# EAGLE design PGTN_daisy3_exp_32io (EAGLE 9.6.0)
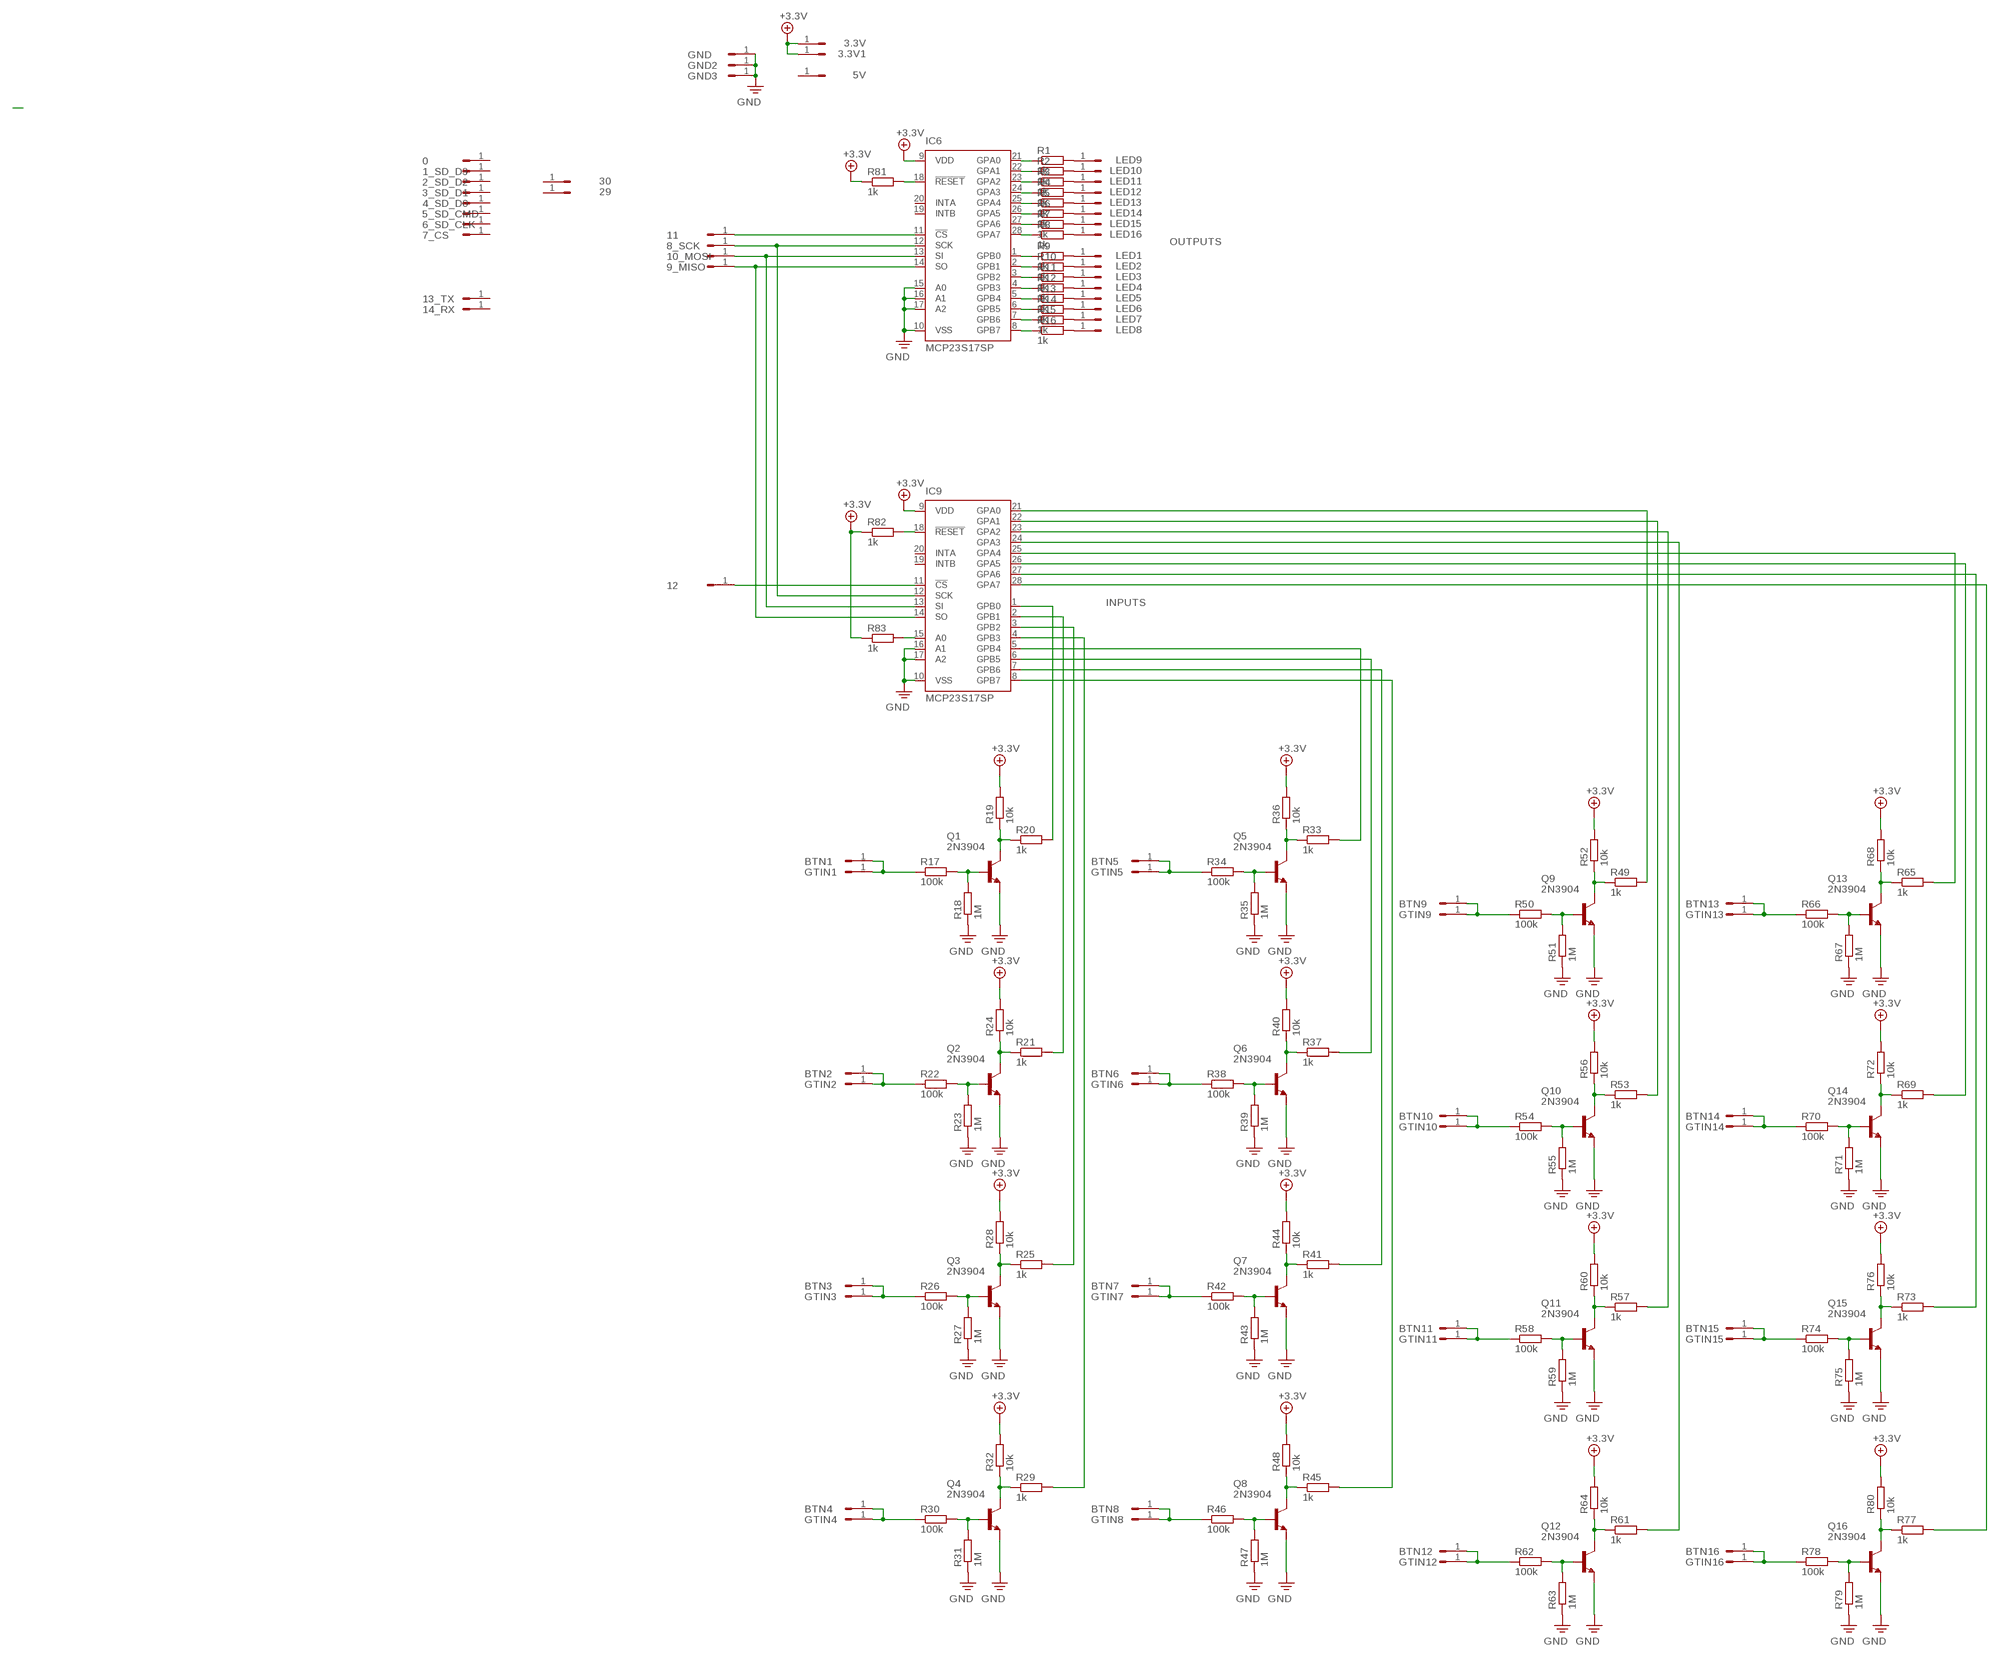
[diagram p0: schematic, sheet 1]

## Parts
0  HEADER/MALE/01  [HEADER/MALE/01]
1_SD_D3  HEADER/MALE/01  [HEADER/MALE/01]
2_SD_D2  HEADER/MALE/01  [HEADER/MALE/01]
3.3V  HEADER/MALE/01  [HEADER/MALE/01]
3.3V1  HEADER/MALE/01  [HEADER/MALE/01]
3_SD_D1  HEADER/MALE/01  [HEADER/MALE/01]
4_SD_D0  HEADER/MALE/01  [HEADER/MALE/01]
5_SD_CMD  HEADER/MALE/01  [HEADER/MALE/01]
5V  HEADER/MALE/01  [HEADER/MALE/01]
6_SD_CLK  HEADER/MALE/01  [HEADER/MALE/01]
7_CS  HEADER/MALE/01  [HEADER/MALE/01]
8_SCK  HEADER/MALE/01  [HEADER/MALE/01]
9_MISO  HEADER/MALE/01  [HEADER/MALE/01]
10_MOSI  HEADER/MALE/01  [HEADER/MALE/01]
11  HEADER/MALE/01  [HEADER/MALE/01]
12  HEADER/MALE/01  [HEADER/MALE/01]
13_TX  HEADER/MALE/01  [HEADER/MALE/01]
14_RX  HEADER/MALE/01  [HEADER/MALE/01]
29  HEADER/MALE/01  [HEADER/MALE/01]
30  HEADER/MALE/01  [HEADER/MALE/01]
BTN1  HEADER/MALE/01  [HEADER/MALE/01]
BTN2  HEADER/MALE/01  [HEADER/MALE/01]
BTN3  HEADER/MALE/01  [HEADER/MALE/01]
BTN4  HEADER/MALE/01  [HEADER/MALE/01]
BTN5  HEADER/MALE/01  [HEADER/MALE/01]
BTN6  HEADER/MALE/01  [HEADER/MALE/01]
BTN7  HEADER/MALE/01  [HEADER/MALE/01]
BTN8  HEADER/MALE/01  [HEADER/MALE/01]
BTN9  HEADER/MALE/01  [HEADER/MALE/01]
BTN10  HEADER/MALE/01  [HEADER/MALE/01]
BTN11  HEADER/MALE/01  [HEADER/MALE/01]
BTN12  HEADER/MALE/01  [HEADER/MALE/01]
BTN13  HEADER/MALE/01  [HEADER/MALE/01]
BTN14  HEADER/MALE/01  [HEADER/MALE/01]
BTN15  HEADER/MALE/01  [HEADER/MALE/01]
BTN16  HEADER/MALE/01  [HEADER/MALE/01]
GND  HEADER/MALE/01  [HEADER/MALE/01]
GND2  HEADER/MALE/01  [HEADER/MALE/01]
GND3  HEADER/MALE/01  [HEADER/MALE/01]
GTIN1  HEADER/MALE/01  [HEADER/MALE/01]
GTIN2  HEADER/MALE/01  [HEADER/MALE/01]
GTIN3  HEADER/MALE/01  [HEADER/MALE/01]
GTIN4  HEADER/MALE/01  [HEADER/MALE/01]
GTIN5  HEADER/MALE/01  [HEADER/MALE/01]
GTIN6  HEADER/MALE/01  [HEADER/MALE/01]
GTIN7  HEADER/MALE/01  [HEADER/MALE/01]
GTIN8  HEADER/MALE/01  [HEADER/MALE/01]
GTIN9  HEADER/MALE/01  [HEADER/MALE/01]
GTIN10  HEADER/MALE/01  [HEADER/MALE/01]
GTIN11  HEADER/MALE/01  [HEADER/MALE/01]
GTIN12  HEADER/MALE/01  [HEADER/MALE/01]
GTIN13  HEADER/MALE/01  [HEADER/MALE/01]
GTIN14  HEADER/MALE/01  [HEADER/MALE/01]
GTIN15  HEADER/MALE/01  [HEADER/MALE/01]
GTIN16  HEADER/MALE/01  [HEADER/MALE/01]
IC6  MCP23S17SP  [DIL28-3]
IC9  MCP23S17SP  [DIL28-3]
LED1  HEADER/MALE/01  [HEADER/MALE/01]
LED2  HEADER/MALE/01  [HEADER/MALE/01]
LED3  HEADER/MALE/01  [HEADER/MALE/01]
LED4  HEADER/MALE/01  [HEADER/MALE/01]
LED5  HEADER/MALE/01  [HEADER/MALE/01]
LED6  HEADER/MALE/01  [HEADER/MALE/01]
LED7  HEADER/MALE/01  [HEADER/MALE/01]
LED8  HEADER/MALE/01  [HEADER/MALE/01]
LED9  HEADER/MALE/01  [HEADER/MALE/01]
LED10  HEADER/MALE/01  [HEADER/MALE/01]
LED11  HEADER/MALE/01  [HEADER/MALE/01]
LED12  HEADER/MALE/01  [HEADER/MALE/01]
LED13  HEADER/MALE/01  [HEADER/MALE/01]
LED14  HEADER/MALE/01  [HEADER/MALE/01]
LED15  HEADER/MALE/01  [HEADER/MALE/01]
LED16  HEADER/MALE/01  [HEADER/MALE/01]
Q1  2N3904  [TO92]
Q2  2N3904  [TO92]
Q3  2N3904  [TO92]
Q4  2N3904  [TO92]
Q5  2N3904  [TO92]
Q6  2N3904  [TO92]
Q7  2N3904  [TO92]
Q8  2N3904  [TO92]
Q9  2N3904  [TO92]
Q10  2N3904  [TO92]
Q11  2N3904  [TO92]
Q12  2N3904  [TO92]
Q13  2N3904  [TO92]
Q14  2N3904  [TO92]
Q15  2N3904  [TO92]
Q16  2N3904  [TO92]
R1  1k  RESISTORRESISTOR/UPRIGHT/7.5  [RESISTOR/7.5]
R2  1k  RESISTORRESISTOR/UPRIGHT/7.5  [RESISTOR/7.5]
R3  1k  RESISTORRESISTOR/UPRIGHT/7.5  [RESISTOR/7.5]
R4  1k  RESISTORRESISTOR/UPRIGHT/7.5  [RESISTOR/7.5]
R5  1k  RESISTORRESISTOR/UPRIGHT/7.5  [RESISTOR/7.5]
R6  1k  RESISTORRESISTOR/UPRIGHT/7.5  [RESISTOR/7.5]
R7  1k  RESISTORRESISTOR/UPRIGHT/7.5  [RESISTOR/7.5]
R8  1k  RESISTORRESISTOR/UPRIGHT/7.5  [RESISTOR/7.5]
R9  1k  RESISTORRESISTOR/UPRIGHT/7.5  [RESISTOR/7.5]
R10  1k  RESISTORRESISTOR/UPRIGHT/7.5  [RESISTOR/7.5]
R11  1k  RESISTORRESISTOR/UPRIGHT/7.5  [RESISTOR/7.5]
R12  1k  RESISTORRESISTOR/UPRIGHT/7.5  [RESISTOR/7.5]
R13  1k  RESISTORRESISTOR/UPRIGHT/7.5  [RESISTOR/7.5]
R14  1k  RESISTORRESISTOR/UPRIGHT/7.5  [RESISTOR/7.5]
R15  1k  RESISTORRESISTOR/UPRIGHT/7.5  [RESISTOR/7.5]
R16  1k  RESISTORRESISTOR/UPRIGHT/7.5  [RESISTOR/7.5]
R17  100k  RESISTORRESISTOR/UPRIGHT/7.5  [RESISTOR/7.5]
R18  1M  RESISTORRESISTOR/UPRIGHT/7.5  [RESISTOR/7.5]
R19  10k  RESISTORRESISTOR/UPRIGHT/7.5  [RESISTOR/7.5]
R20  1k  RESISTORRESISTOR/UPRIGHT/7.5  [RESISTOR/7.5]
R21  1k  RESISTORRESISTOR/UPRIGHT/7.5  [RESISTOR/7.5]
R22  100k  RESISTORRESISTOR/UPRIGHT/7.5  [RESISTOR/7.5]
R23  1M  RESISTORRESISTOR/UPRIGHT/7.5  [RESISTOR/7.5]
R24  10k  RESISTORRESISTOR/UPRIGHT/7.5  [RESISTOR/7.5]
R25  1k  RESISTORRESISTOR/UPRIGHT/7.5  [RESISTOR/7.5]
R26  100k  RESISTORRESISTOR/UPRIGHT/7.5  [RESISTOR/7.5]
R27  1M  RESISTORRESISTOR/UPRIGHT/7.5  [RESISTOR/7.5]
R28  10k  RESISTORRESISTOR/UPRIGHT/7.5  [RESISTOR/7.5]
R29  1k  RESISTORRESISTOR/UPRIGHT/7.5  [RESISTOR/7.5]
R30  100k  RESISTORRESISTOR/UPRIGHT/7.5  [RESISTOR/7.5]
R31  1M  RESISTORRESISTOR/UPRIGHT/7.5  [RESISTOR/7.5]
R32  10k  RESISTORRESISTOR/UPRIGHT/7.5  [RESISTOR/7.5]
R33  1k  RESISTORRESISTOR/UPRIGHT/7.5  [RESISTOR/7.5]
R34  100k  RESISTORRESISTOR/UPRIGHT/7.5  [RESISTOR/7.5]
R35  1M  RESISTORRESISTOR/UPRIGHT/7.5  [RESISTOR/7.5]
R36  10k  RESISTORRESISTOR/UPRIGHT/7.5  [RESISTOR/7.5]
R37  1k  RESISTORRESISTOR/UPRIGHT/7.5  [RESISTOR/7.5]
R38  100k  RESISTORRESISTOR/UPRIGHT/7.5  [RESISTOR/7.5]
R39  1M  RESISTORRESISTOR/UPRIGHT/7.5  [RESISTOR/7.5]
R40  10k  RESISTORRESISTOR/UPRIGHT/7.5  [RESISTOR/7.5]
R41  1k  RESISTORRESISTOR/UPRIGHT/7.5  [RESISTOR/7.5]
R42  100k  RESISTORRESISTOR/UPRIGHT/7.5  [RESISTOR/7.5]
R43  1M  RESISTORRESISTOR/UPRIGHT/7.5  [RESISTOR/7.5]
R44  10k  RESISTORRESISTOR/UPRIGHT/7.5  [RESISTOR/7.5]
R45  1k  RESISTORRESISTOR/UPRIGHT/7.5  [RESISTOR/7.5]
R46  100k  RESISTORRESISTOR/UPRIGHT/7.5  [RESISTOR/7.5]
R47  1M  RESISTORRESISTOR/UPRIGHT/7.5  [RESISTOR/7.5]
R48  10k  RESISTORRESISTOR/UPRIGHT/7.5  [RESISTOR/7.5]
R49  1k  RESISTORRESISTOR/UPRIGHT/7.5  [RESISTOR/7.5]
R50  100k  RESISTORRESISTOR/UPRIGHT/7.5  [RESISTOR/7.5]
R51  1M  RESISTORRESISTOR/UPRIGHT/7.5  [RESISTOR/7.5]
R52  10k  RESISTORRESISTOR/UPRIGHT/7.5  [RESISTOR/7.5]
R53  1k  RESISTORRESISTOR/UPRIGHT/7.5  [RESISTOR/7.5]
R54  100k  RESISTORRESISTOR/UPRIGHT/7.5  [RESISTOR/7.5]
R55  1M  RESISTORRESISTOR/UPRIGHT/7.5  [RESISTOR/7.5]
R56  10k  RESISTORRESISTOR/UPRIGHT/7.5  [RESISTOR/7.5]
R57  1k  RESISTORRESISTOR/UPRIGHT/7.5  [RESISTOR/7.5]
R58  100k  RESISTORRESISTOR/UPRIGHT/7.5  [RESISTOR/7.5]
R59  1M  RESISTORRESISTOR/UPRIGHT/7.5  [RESISTOR/7.5]
R60  10k  RESISTORRESISTOR/UPRIGHT/7.5  [RESISTOR/7.5]
R61  1k  RESISTORRESISTOR/UPRIGHT/7.5  [RESISTOR/7.5]
R62  100k  RESISTORRESISTOR/UPRIGHT/7.5  [RESISTOR/7.5]
R63  1M  RESISTORRESISTOR/UPRIGHT/7.5  [RESISTOR/7.5]
R64  10k  RESISTORRESISTOR/UPRIGHT/7.5  [RESISTOR/7.5]
R65  1k  RESISTORRESISTOR/UPRIGHT/7.5  [RESISTOR/7.5]
R66  100k  RESISTORRESISTOR/UPRIGHT/7.5  [RESISTOR/7.5]
R67  1M  RESISTORRESISTOR/UPRIGHT/7.5  [RESISTOR/7.5]
R68  10k  RESISTORRESISTOR/UPRIGHT/7.5  [RESISTOR/7.5]
R69  1k  RESISTORRESISTOR/UPRIGHT/7.5  [RESISTOR/7.5]
R70  100k  RESISTORRESISTOR/UPRIGHT/7.5  [RESISTOR/7.5]
R71  1M  RESISTORRESISTOR/UPRIGHT/7.5  [RESISTOR/7.5]
R72  10k  RESISTORRESISTOR/UPRIGHT/7.5  [RESISTOR/7.5]
R73  1k  RESISTORRESISTOR/UPRIGHT/7.5  [RESISTOR/7.5]
R74  100k  RESISTORRESISTOR/UPRIGHT/7.5  [RESISTOR/7.5]
R75  1M  RESISTORRESISTOR/UPRIGHT/7.5  [RESISTOR/7.5]
R76  10k  RESISTORRESISTOR/UPRIGHT/7.5  [RESISTOR/7.5]
R77  1k  RESISTORRESISTOR/UPRIGHT/7.5  [RESISTOR/7.5]
R78  100k  RESISTORRESISTOR/UPRIGHT/7.5  [RESISTOR/7.5]
R79  1M  RESISTORRESISTOR/UPRIGHT/7.5  [RESISTOR/7.5]
R80  10k  RESISTORRESISTOR/UPRIGHT/7.5  [RESISTOR/7.5]
R81  1k  RESISTORRESISTOR/UPRIGHT/7.5  [RESISTOR/7.5]
R82  1k  RESISTORRESISTOR/UPRIGHT/7.5  [RESISTOR/7.5]
R83  1k  RESISTORRESISTOR/UPRIGHT/7.5  [RESISTOR/7.5]

## Nets
25_GTIN1: IC9.23(GPA2) R57.2
25_GTIN2: IC9.24(GPA3) R61.2
25_GTIN3: IC9.3(GPB2) R25.2
25_GTIN4: IC9.4(GPB3) R29.2
25_GTIN5: IC9.5(GPB4) R33.2
25_GTIN6: IC9.6(GPB5) R37.2
25_GTIN7: IC9.7(GPB6) R41.2
25_GTIN8: IC9.8(GPB7) R45.2
25_GTIN9: IC9.25(GPA4) R65.2
25_GTIN10: IC9.26(GPA5) R69.2
25_GTIN11: IC9.27(GPA6) R73.2
25_GTIN12: IC9.28(GPA7) R77.2
+5V: 3.3V1.1 3.3V.1 IC6.9(VDD) IC9.9(VDD) R19.2 R24.2 R28.2 R32.2 R36.2 R40.2 R44.2 R48.2 R52.2 R56.2 R60.2 R64.2 R68.2 R72.2 R76.2 R80.2 R81.1 R82.1 R83.1 ; supply symbol labelled +3.3V
N$1: BTN2.1 GTIN2.1 R22.1
N$2: Q2.2(B) R22.2 R23.2
N$3: Q2.1(C) R21.1 R24.1
N$4: BTN3.1 GTIN3.1 R26.1
N$5: Q3.2(B) R26.2 R27.2
N$6: Q3.1(C) R25.1 R28.1
N$7: BTN4.1 GTIN4.1 R30.1
N$8: IC6.21(GPA0) R1.1
N$9: Q4.2(B) R30.2 R31.2
N$10: Q4.1(C) R29.1 R32.1
N$11: BTN5.1 GTIN5.1 R34.1
N$12: Q5.2(B) R34.2 R35.2
N$13: IC6.22(GPA1) R2.1
N$14: IC6.23(GPA2) R3.1
N$15: Q5.1(C) R33.1 R36.1
N$16: IC6.24(GPA3) R4.1
N$17: BTN6.1 GTIN6.1 R38.1
N$18: IC6.25(GPA4) R5.1
N$19: IC6.26(GPA5) R6.1
N$20: Q6.2(B) R38.2 R39.2
N$21: Q6.1(C) R37.1 R40.1
N$22: BTN7.1 GTIN7.1 R42.1
N$24: Q7.2(B) R42.2 R43.2
N$25: IC6.27(GPA6) R7.1
N$26: Q7.1(C) R41.1 R44.1
N$27: BTN8.1 GTIN8.1 R46.1
N$29: Q8.2(B) R46.2 R47.2
N$30: Q8.1(C) R45.1 R48.1
N$31: IC9.1(GPB0) R20.2
N$32: IC9.2(GPB1) R21.2
N$33: 9_MISO.1 IC6.14(SO) IC9.14(SO)
N$34: 8_SCK.1 IC6.12(SCK) IC9.12(SCK)
N$35: 10_MOSI.1 IC6.13(SI) IC9.13(SI)
N$36: 11.1 IC6.11(!CS)
N$37: 12.1 IC9.11(!CS)
N$38: BTN9.1 GTIN9.1 R50.1
N$39: Q9.2(B) R50.2 R51.2
N$40: Q9.1(C) R49.1 R52.1
N$41: BTN10.1 GTIN10.1 R54.1
N$43: Q10.2(B) R54.2 R55.2
N$44: Q10.1(C) R53.1 R56.1
N$45: BTN11.1 GTIN11.1 R58.1
N$46: Q11.2(B) R58.2 R59.2
N$48: Q11.1(C) R57.1 R60.1
N$49: BTN12.1 GTIN12.1 R62.1
N$50: Q12.2(B) R62.2 R63.2
N$51: Q12.1(C) R61.1 R64.1
N$52: BTN13.1 GTIN13.1 R66.1
N$54: IC6.28(GPA7) R8.1
N$55: IC6.1(GPB0) R9.1
N$56: IC6.2(GPB1) R10.1
N$57: IC6.3(GPB2) R11.1
N$58: IC6.4(GPB3) R12.1
N$59: IC6.5(GPB4) R13.1
N$60: IC6.6(GPB5) R14.1
N$66: Q13.2(B) R66.2 R67.2
N$67: Q13.1(C) R65.1 R68.1
N$68: IC6.7(GPB6) R15.1
N$69: IC6.8(GPB7) R16.1
N$70: BTN1.1 GTIN1.1 R17.1
N$71: Q1.2(B) R17.2 R18.2
N$72: Q1.1(C) R19.1 R20.1
N$74: BTN14.1 GTIN14.1 R70.1
N$75: Q14.2(B) R70.2 R71.2
N$76: Q14.1(C) R69.1 R72.1
N$77: BTN15.1 GTIN15.1 R74.1
N$78: Q15.2(B) R74.2 R75.2
N$79: Q15.1(C) R73.1 R76.1
N$80: BTN16.1 GTIN16.1 R78.1
N$81: Q16.2(B) R78.2 R79.2
N$82: Q16.1(C) R77.1 R80.1
N$83: IC9.21(GPA0) R49.2
N$84: IC9.22(GPA1) R53.2
N$85: LED1.1 R9.2
N$86: LED2.1 R10.2
N$87: LED3.1 R11.2
N$88: LED4.1 R12.2
N$89: LED5.1 R13.2
N$90: LED6.1 R14.2
N$91: LED7.1 R15.2
N$92: LED8.1 R16.2
N$93: LED9.1 R1.2
N$94: LED10.1 R2.2
N$95: LED11.1 R3.2
N$96: LED12.1 R4.2
N$97: LED13.1 R5.2
N$98: LED14.1 R6.2
N$99: LED15.1 R7.2
N$100: LED16.1 R8.2
N$101: IC6.18(!RESET) R81.2
N$102: IC9.18(!RESET) R82.2
N$108: IC9.15(A0) R83.2
PE: GND2.1 GND3.1 GND.1 IC6.10(VSS) IC6.15(A0) IC6.16(A1) IC6.17(A2) IC9.10(VSS) IC9.16(A1) IC9.17(A2) Q1.3(E) Q2.3(E) Q3.3(E) Q4.3(E) Q5.3(E) Q6.3(E) Q7.3(E) Q8.3(E) Q9.3(E) Q10.3(E) Q11.3(E) Q12.3(E) Q13.3(E) Q14.3(E) Q15.3(E) Q16.3(E) R18.1 R23.1 R27.1 R31.1 R35.1 R39.1 R43.1 R47.1 R51.1 R55.1 R59.1 R63.1 R67.1 R71.1 R75.1 R79.1 ; supply symbol labelled GND
Unconnected: 0.1 1_SD_D3.1 2_SD_D2.1 3_SD_D1.1 4_SD_D0.1 5_SD_CMD.1 5V.1 6_SD_CLK.1 7_CS.1 13_TX.1 14_RX.1 29.1 30.1 IC6.19(INTB) IC6.20(INTA) IC9.19(INTB) IC9.20(INTA)

## Notes on the sheet
- OUTPUTS
- INPUTS

## Library data of the parts
0 1_SD_D3 2_SD_D2 3.3V 3.3V1 3_SD_D1 4_SD_D0 5_SD_CMD 5V 6_SD_CLK 7_CS 8_SCK 9_MISO 10_MOSI 11 12 13_TX 14_RX 29 30 BTN1-BTN16 GND GND2 GND3 GTIN1-GTIN16 LED1-LED16 = connectors:HEADER/MALE/01; SPICEPREFIX: X
IC6 IC9 = ic_digital:MCP23S17: http://ww1.microchip.com/downloads/en/DeviceDoc/21952a.pdf Source: http://ww1.microchip.com/downloads/en/DeviceDoc/21952a.pdf; MF: MICROCHIP; MPN: MCP23S17-E/SP; OC_FARNELL: 1292238; OC_NEWARK: 31K2951
Q1-Q16 = transistors:2N3904: NPN Transistor
R1-R83 = resistors:RESISTOR: RESISTOR, European symbol

## Board
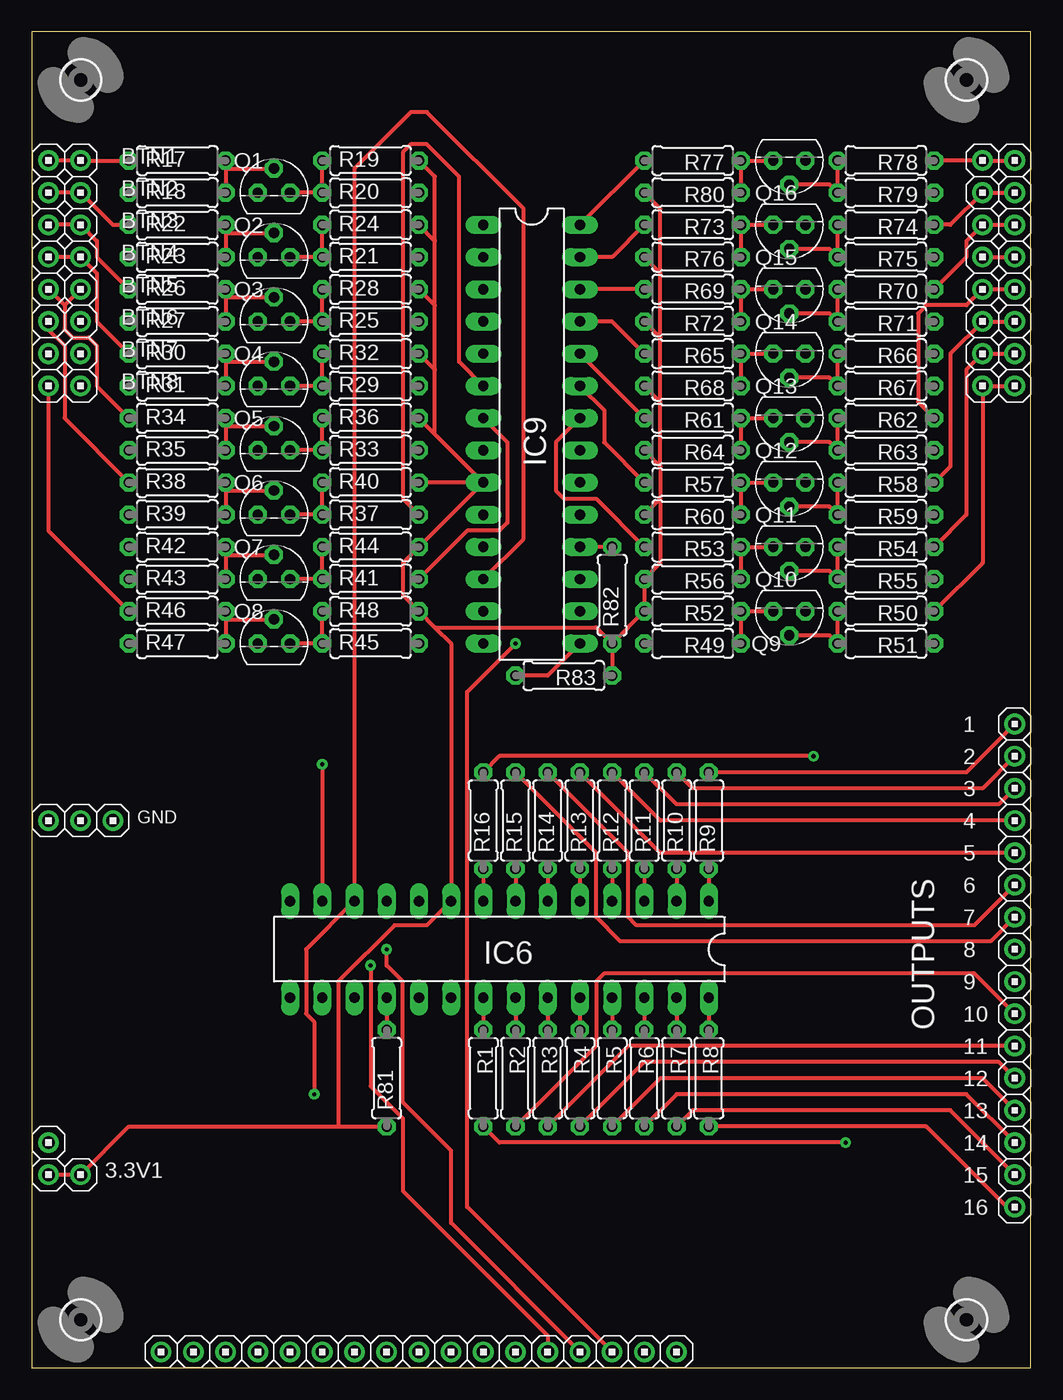
[diagram p1: board, top side]
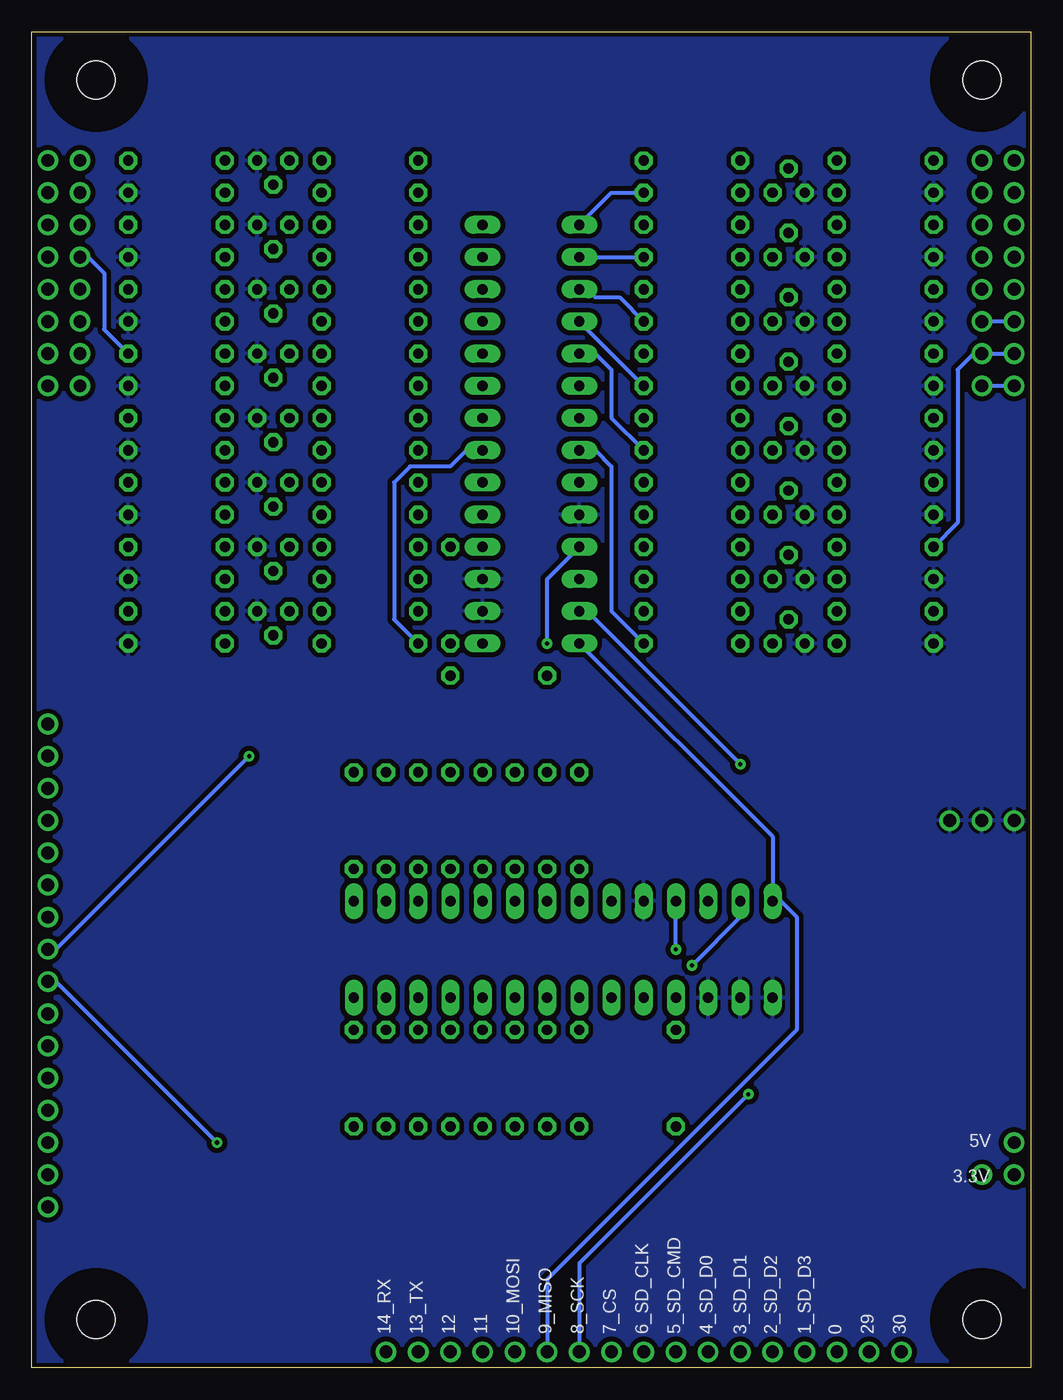
[diagram p2: board, bottom side, seen from below]

Size 78.79 x 105.4 mm. Coordinates in mm from the lower left corner, seen from the top.
Outline: 78.79,105.4 0,105.4 0,0 78.79,0 78.79,105.4
Copper layers (1*16): Top 0.0356mm / dielectric 1.5011mm / Bottom 0.0356mm
Design rules "pigatron": minimum track width 12mil, minimum drill 13mil, track to track 15mil, track to pad 10mil, pad to pad 10mil, via to via 10mil, smd to smd 6mil, copper to edge 15mil, drill to drill 10mil, minimum pad ring 12mil, minimum via ring 10mil, stop-mask expansion 4mil, vias tented up to drill 0mil, thermal gap 10mil

### Footprints (pad centres in the part's own frame; a part is rotated, then mirrored left to right if it is on the bottom)
HEADER/MALE/01 = drill 1.016: 1 0,0
DIL28-3 = drill 0.813 long: 1 -16.51,-3.81; 2 -13.97,-3.81; 3 -11.43,-3.81; 4 -8.89,-3.81; 5 -6.35,-3.81; 6 -3.81,-3.81; 7 -1.27,-3.81; 8 1.27,-3.81; 9 3.81,-3.81; 10 6.35,-3.81; 11 8.89,-3.81; 12 11.43,-3.81; 13 13.97,-3.81; 14 16.51,-3.81; 15 16.51,3.81; 16 13.97,3.81; 17 11.43,3.81; 18 8.89,3.81; 19 6.35,3.81; 20 3.81,3.81; 21 1.27,3.81; 22 -1.27,3.81; 23 -3.81,3.81; 24 -6.35,3.81; 25 -8.89,3.81; 26 -11.43,3.81; 27 -13.97,3.81; 28 -16.51,3.81
TO92 = drill 0.813 octagon: 1 1.27,0; 2 0,1.905; 3 -1.27,0
RESISTOR/7.5 = drill 0.813 octagon: 1 -3.81,0; 2 3.81,0
STANDOFF/3.0 = hole 3: 0,0

### Placement (x,y rotation side)
0  15.29,1.26 90 top
1_SD_D3  17.83,1.26 90 top
2_SD_D2  20.37,1.26 90 top
3.3V  1.32,15.23 270 top
3.3V1  3.86,15.23 0 top
3_SD_D1  22.91,1.26 90 top
4_SD_D0  25.45,1.26 90 top
5_SD_CMD  27.99,1.26 90 top
5V  1.32,17.77 180 top
6_SD_CLK  30.53,1.26 90 top
7_CS  33.07,1.26 90 top
8_SCK  35.61,1.26 90 top
9_MISO  38.15,1.26 90 top
10_MOSI  40.69,1.26 90 top
11  43.23,1.26 90 top
12  45.77,1.26 90 top
13_TX  48.31,1.26 90 top
14_RX  50.85,1.26 90 top
29  12.75,1.26 90 top
30  10.21,1.26 90 top
BTN1  3.86,95.24 0 top
BTN2  3.86,92.7 0 top
BTN3  3.86,90.16 0 top
BTN4  3.86,87.62 0 top
BTN5  3.86,85.08 0 top
BTN6  3.86,82.54 0 top
BTN7  3.86,80 0 top
BTN8  3.86,77.46 0 top
BTN9  74.98,77.46 0 top
BTN10  74.98,80 0 top
BTN11  74.98,82.54 0 top
BTN12  74.98,85.08 0 top
BTN13  74.98,87.62 0 top
BTN14  74.98,90.16 0 top
BTN15  74.98,92.7 0 top
BTN16  74.98,95.24 0 top
GND  6.4,43.17 0 top
GND2  1.32,43.17 180 top
GND3  3.86,43.17 180 top
GTIN1  1.32,95.24 0 top
GTIN2  1.32,92.7 0 top
GTIN3  1.32,90.16 0 top
GTIN4  1.32,87.62 0 top
GTIN5  1.32,85.08 0 top
GTIN6  1.32,82.54 0 top
GTIN7  1.32,80 0 top
GTIN8  1.32,77.46 0 top
GTIN9  77.52,77.46 0 top
GTIN10  77.52,80 0 top
GTIN11  77.52,82.54 0 top
GTIN12  77.52,85.08 0 top
GTIN13  77.52,87.62 0 top
GTIN14  77.52,90.16 0 top
GTIN15  77.52,92.7 0 top
GTIN16  77.52,95.24 0 top
IC6  36.88,33.01 180 top
IC9  39.42,73.65 270 top
LED1  77.52,50.79 180 top
LED2  77.52,48.25 180 top
LED3  77.52,45.71 0 top
LED4  77.52,43.17 0 top
LED5  77.52,40.63 0 top
LED6  77.52,38.09 0 top
LED7  77.52,35.55 0 top
LED8  77.52,33.01 0 top
LED9  77.52,30.47 0 top
LED10  77.52,27.93 0 top
LED11  77.52,25.39 0 top
LED12  77.52,22.85 0 top
LED13  77.52,20.31 0 top
LED14  77.52,17.77 0 top
LED15  77.52,15.23 0 top
LED16  77.52,12.69 0 top
Q1  19.1,92.7 0 top
Q2  19.1,87.62 0 top
Q3  19.1,82.54 0 top
Q4  19.1,77.46 0 top
Q5  19.1,72.38 0 top
Q6  19.1,67.3 0 top
Q7  19.1,62.22 0 top
Q8  19.1,57.14 0 top
Q9  59.74,59.68 180 top
Q10  59.74,64.76 180 top
Q11  59.74,69.84 180 top
Q12  59.74,74.92 180 top
Q13  59.74,80 180 top
Q14  59.74,85.08 180 top
Q15  59.74,90.16 180 top
Q16  59.74,95.24 180 top
R1  35.61,22.85 270 top
R2  38.15,22.85 270 top
R3  40.69,22.85 270 top
R4  43.23,22.85 270 top
R5  45.77,22.85 270 top
R6  48.31,22.85 270 top
R7  50.85,22.85 270 top
R8  53.39,22.85 270 top
R9  53.39,43.17 90 top
R10  50.85,43.17 90 top
R11  48.31,43.17 90 top
R12  45.77,43.17 90 top
R13  43.23,43.17 90 top
R14  40.69,43.17 90 top
R15  38.15,43.17 90 top
R16  35.61,43.17 90 top
R17  11.48,95.24 0 top
R18  11.48,92.7 0 top
R19  26.72,95.24 0 top
R20  26.72,92.7 0 top
R21  26.72,87.62 0 top
R22  11.48,90.16 0 top
R23  11.48,87.62 0 top
R24  26.72,90.16 0 top
R25  26.72,82.54 0 top
R26  11.48,85.08 0 top
R27  11.48,82.54 0 top
R28  26.72,85.08 0 top
R29  26.72,77.46 0 top
R30  11.48,80 0 top
R31  11.48,77.46 0 top
R32  26.72,80 0 top
R33  26.72,72.38 0 top
R34  11.48,74.92 0 top
R35  11.48,72.38 0 top
R36  26.72,74.92 0 top
R37  26.72,67.3 0 top
R38  11.48,69.84 0 top
R39  11.48,67.3 0 top
R40  26.72,69.84 0 top
R41  26.72,62.22 0 top
R42  11.48,64.76 0 top
R43  11.48,62.22 0 top
R44  26.72,64.76 0 top
R45  26.72,57.14 0 top
R46  11.48,59.68 0 top
R47  11.48,57.14 0 top
R48  26.72,59.68 0 top
R49  52.12,57.14 180 top
R50  67.36,59.68 180 top
R51  67.36,57.14 180 top
R52  52.12,59.68 180 top
R53  52.12,64.76 180 top
R54  67.36,64.76 180 top
R55  67.36,62.22 180 top
R56  52.12,62.22 180 top
R57  52.12,69.84 180 top
R58  67.36,69.84 180 top
R59  67.36,67.3 180 top
R60  52.12,67.3 180 top
R61  52.12,74.92 180 top
R62  67.36,74.92 180 top
R63  67.36,72.38 180 top
R64  52.12,72.38 180 top
R65  52.12,80 180 top
R66  67.36,80 180 top
R67  67.36,77.46 180 top
R68  52.12,77.46 180 top
R69  52.12,85.08 180 top
R70  67.36,85.08 180 top
R71  67.36,82.54 180 top
R72  52.12,82.54 180 top
R73  52.12,90.16 180 top
R74  67.36,90.16 180 top
R75  67.36,87.62 180 top
R76  52.12,87.62 180 top
R77  52.12,95.24 180 top
R78  67.36,95.24 180 top
R79  67.36,92.7 180 top
R80  52.12,92.7 180 top
R81  27.99,22.85 90 top
R82  45.77,60.95 90 top
R83  41.96,54.6 180 top
U$1  [PIGATRON-LOGO]  98.09,35.3 0 top  (outside the outline)
U$2  [STANDOFF/3.0]  73.71,3.8 180 top
U$3  [STANDOFF/3.0]  3.86,3.8 180 top
U$4  [STANDOFF/3.0]  3.86,101.59 0 top
U$5  [PIGATRON-LOGO]  100.64,68.32 0 top  (outside the outline)
U$7  [STANDOFF/3.0]  73.71,101.59 0 top

### Tracks (layer width: path | path; a pad name or v marks a point on that pad's centre or on a via)
25_GTIN1
  Top 0.305: R57.2 45.14,73.02 45.14,75.55 IC9.23
25_GTIN2
  Top 0.305: R61.2 IC9.24
25_GTIN3
  Bottom 0.305: R25.2 32.44,84.44 34.34,84.44 34.98,85.08 IC9.3
25_GTIN4
  Bottom 0.305: IC9.4 R29.2
25_GTIN5
  Bottom 0.305: R33.2 33.07,74.92 33.07,78.73 34.34,80 IC9.5
25_GTIN6
  Top 0.305: R37.2 29.26,68.57 29.26,95.88 29.9,96.51 31.17,96.51 33.71,93.97 33.71,79.36 IC9.6
25_GTIN7
  Top 0.305: R41.2 34.34,66.03 36.88,66.03 37.52,66.66 37.52,73.02 IC9.7
25_GTIN8
  Bottom 0.305: R45.2 33.07,59.68 33.07,71.11 34.34,72.38 IC9.8
25_GTIN9
  Top 0.305: IC9.25 45.77,82.54 R65.2
25_GTIN10
  Top 0.305: R69.2 IC9.26
25_GTIN11
  Top 0.305: IC9.27 45.77,87.62 R73.2
25_GTIN12
  Top 0.305: R77.2 IC9.28
+5V
  Top 0.305: R82.1 R83.1 | R82.1 R52.2 R56.2 49.58,63.49 49.58,68.57 | 49.58,68.57 R60.2 | 49.58,71.11 49.58,68.57 | R64.2 49.58,71.11 | 49.58,76.19 R68.2 | 49.58,71.11 49.58,76.19 | 49.58,81.27 R72.2 | 49.58,76.19 49.58,81.27 | 49.58,86.35 R76.2 | 49.58,81.27 49.58,86.35 | R80.2 49.58,91.43 49.58,86.35 | 24.18,19.04 7.67,19.04 3.3V1.1 3.3V.1 | 24.18,19.04 R81.1 | 31.8,58.41 R48.2 29.26,60.95 29.26,63.49 R44.2 IC9.9 | 31.8,58.41 33.07,57.14 IC6.9 31.17,34.91 28.63,34.91 24.18,30.47 24.18,19.04 | IC9.9 R40.2 | IC9.9 31.8,73.65 | 31.8,73.65 R36.2 | 31.8,78.73 R32.2 | 31.8,73.65 31.8,78.73 | 31.8,83.81 R28.2 | 31.8,78.73 31.8,83.81 | 31.8,88.89 R24.2 | 31.8,83.81 31.8,88.89 | R19.2 31.8,93.97 31.8,88.89 | R82.1 44.5,58.41 31.8,58.41
N$1
  Top 0.305: R22.1 6.4,90.16 BTN2.1 GTIN2.1
N$2
  Top 0.305: 15.29,89.52 R23.2 | 15.29,89.52 Q2.2 | 15.29,89.52 R22.2
N$3
  Top 0.305: Q2.1 R21.1 R24.1
N$4
  Top 0.305: R26.1 5.13,87.62 5.13,88.89 BTN3.1 GTIN3.1
N$5
  Top 0.305: 15.29,84.44 R27.2 | 15.29,84.44 Q3.2 | 15.29,84.44 R26.2
N$6
  Top 0.305: Q3.1 R25.1 R28.1
N$7
  Top 0.305: R30.1 5.13,82.54 5.13,86.35 BTN4.1 GTIN4.1
N$8
  Top 0.305: IC6.21 R1.1
N$9
  Top 0.305: 15.29,79.36 R31.2 | 15.29,79.36 Q4.2 | 15.29,79.36 R30.2
N$10
  Top 0.305: Q4.1 R29.1 R32.1
N$11
  Top 0.305: R34.1 5.13,77.46 5.13,80.63 4.5,81.27 3.23,81.27 2.59,81.91 2.59,83.81 | BTN5.1 2.59,83.81 | 2.59,83.81 GTIN5.1
N$12
  Top 0.305: 15.29,74.28 R35.2 | 15.29,74.28 Q5.2 | 15.29,74.28 R34.2
N$13
  Top 0.305: IC6.22 R2.1
N$14
  Top 0.305: IC6.23 R3.1
N$15
  Top 0.305: Q5.1 R33.1 R36.1
N$16
  Top 0.305: IC6.24 R4.1
N$17
  Top 0.305: R38.1 2.59,74.92 2.59,80.63 1.32,81.91 GTIN6.1
  Bottom 0.305: GTIN6.1 BTN6.1
N$18
  Top 0.305: IC6.25 R5.1
N$19
  Top 0.305: IC6.26 R6.1
N$20
  Top 0.305: 15.29,69.2 R39.2 | 15.29,69.2 Q6.2 | 15.29,69.2 R38.2
N$21
  Top 0.305: Q6.1 R37.1 R40.1
N$22
  Bottom 0.305: R42.1 5.77,66.66 5.77,78.73 4.5,80 BTN7.1 GTIN7.1
N$24
  Top 0.305: 15.29,64.12 R43.2 | 15.29,64.12 Q7.2 | 15.29,64.12 R42.2
N$25
  Top 0.305: IC6.27 R7.1
N$26
  Top 0.305: Q7.1 R41.1 R44.1
N$27
  Top 0.305: R46.1 1.32,66.03 GTIN8.1
  Bottom 0.305: GTIN8.1 BTN8.1
N$29
  Top 0.305: 15.29,59.05 R47.2 | 15.29,59.05 Q8.2 | 15.29,59.05 R46.2
N$30
  Top 0.305: Q8.1 R45.1 R48.1
N$31
  Bottom 0.305: R20.2 33.07,92.7 IC9.1
N$32
  Bottom 0.305: IC9.2 R21.2
N$33
  Bottom 0.305: 20.37,37.46 20.37,41.9 IC9.14 | 9_MISO.1 38.15,6.98 18.47,26.66 18.47,35.55 20.37,37.46 | 20.37,37.46 IC6.14
N$34  (via drill 0.33)
  Top 0.305: IC9.12 38.79,65.39 38.79,91.43 31.17,99.05 29.9,99.05 25.45,94.6 IC6.12 21.64,33.01 21.64,27.93 22.28,27.29 v22.28,21.58
  Bottom 0.305: 8_SCK.1 35.61,8.25 v22.28,21.58
N$35  (via drill 0.33)
  Top 0.305: v22.91,47.62 IC6.13 | 10_MOSI.1 40.69,2.53 29.26,13.96 29.26,19.67 26.72,22.21 v26.72,31.74
  Bottom 0.305: v22.91,47.62 34.98,59.68 IC9.13 | v26.72,31.74 22.91,35.55 IC6.13
N$36  (via drill 0.33)
  Top 0.305: v27.99,33.01 27.99,31.74 29.26,30.47 29.26,20.94 33.07,17.13 33.07,11.42 11.1
  Bottom 0.305: v27.99,33.01 IC6.11
N$37  (via drill 0.33)
  Top 0.305: v38.15,57.14 34.34,53.33 34.34,12.69 12.1
  Bottom 0.305: IC9.11 38.15,62.22 v38.15,57.14
N$38
  Top 0.305: R50.1 74.98,63.49 BTN9.1 GTIN9.1
N$39
  Top 0.305: Q9.2 62.92,57.77 R51.2 R50.2
N$40
  Top 0.305: R49.1 R52.1 Q9.1
N$41
  Top 0.305: R54.1 73.71,67.3 73.71,78.73 BTN10.1 GTIN10.1
N$43
  Top 0.305: Q10.2 62.92,62.86 R55.2 R54.2
N$44
  Top 0.305: R56.1 R53.1 Q10.1
N$45
  Top 0.305: R58.1 72.44,71.11 72.44,80 BTN11.1 GTIN11.1
N$46
  Top 0.305: Q11.2 62.92,67.93 R59.2 R58.2
N$48
  Top 0.305: R60.1 R57.1 Q11.1
N$49
  Top 0.305: R62.1 69.9,76.19 69.9,83.17 70.54,83.81 73.71,83.81 BTN12.1 GTIN12.1
N$50
  Top 0.305: Q12.2 62.92,73.02 R63.2 R62.2
N$51
  Top 0.305: R64.1 R61.1 Q12.1
N$52
  Top 0.305: BTN13.1 GTIN13.1
  Bottom 0.305: R66.1 73.08,81.91 73.08,86.35 74.35,87.62 BTN13.1
N$54
  Top 0.305: IC6.28 R8.1
N$55
  Top 0.305: R9.1 IC6.1
N$56
  Top 0.305: R10.1 IC6.2
N$57
  Top 0.305: R11.1 IC6.3
N$58
  Top 0.305: R12.1 IC6.4
N$59
  Top 0.305: R13.1 IC6.5
N$60
  Top 0.305: R14.1 IC6.6
N$66
  Top 0.305: Q13.2 62.92,78.09 R67.2 R66.2
N$67
  Top 0.305: R68.1 R65.1 Q13.1
N$68
  Top 0.305: R15.1 IC6.7
N$69
  Top 0.305: R16.1 IC6.8
N$70
  Top 0.305: R17.1 BTN1.1 GTIN1.1
N$71
  Top 0.305: 15.29,94.6 R18.2 | 15.29,94.6 Q1.2 | 15.29,94.6 R17.2
N$72
  Top 0.305: Q1.1 R20.1 R19.1
N$74
  Top 0.305: R70.1 73.71,87.62 73.71,88.89 BTN14.1 GTIN14.1
N$75
  Top 0.305: Q14.2 62.92,83.17 R71.2 R70.2
N$76
  Top 0.305: R72.1 R69.1 Q14.1
N$77
  Top 0.305: R74.1 72.44,90.16 BTN15.1 GTIN15.1
N$78
  Top 0.305: Q15.2 62.92,88.25 R75.2 R74.2
N$79
  Top 0.305: R76.1 R73.1 Q15.1
N$80
  Top 0.305: R78.1 BTN16.1 GTIN16.1
N$81
  Top 0.305: Q16.2 62.92,93.33 R79.2 R78.2
N$82
  Top 0.305: R80.1 R77.1 Q16.1
N$83
  Bottom 0.305: R49.2 50.22,59.05 50.22,69.84 48.95,71.11 45.77,71.11 44.5,72.38 IC9.21
N$84
  Top 0.305: R53.2 44.5,68.57 41.96,68.57 41.33,69.2 41.33,73.02 IC9.22
N$85
  Top 0.305: R9.2 73.71,46.98 LED1.1
N$86
  Top 0.305: R10.2 52.12,45.71 74.98,45.71 LED2.1
N$87
  Top 0.305: R11.2 50.85,44.44 76.25,44.44 LED3.1
N$88
  Top 0.305: R12.2 49.58,43.17 LED4.1
N$89
  Top 0.305: R13.2 49.58,40.63 LED5.1
N$90
  Top 0.305: R14.2 47.04,40.63 47.04,35.55 47.68,34.91 74.35,34.91 LED6.1
N$91
  Top 0.305: R15.2 44.5,40.63 44.5,35.55 46.41,33.65 75.62,33.65 LED7.1
N$92  (via drill 0.33)
  Top 0.305: R16.2 36.88,48.25 v61.65,48.25
  Bottom 0.305: v61.65,48.25 76.89,33.01 LED8.1
N$93  (via drill 0.33)
  Top 0.305: R1.2 36.88,17.77 v64.19,17.77
  Bottom 0.305: v64.19,17.77 76.89,30.47 LED9.1
N$94
  Top 0.305: R2.2 44.5,25.39 44.5,30.47 45.14,31.1 74.35,31.1 LED10.1
N$95
  Top 0.305: R3.2 47.04,25.39 LED11.1
N$96
  Top 0.305: R4.2 48.31,24.12 76.25,24.12 LED12.1
N$97
  Top 0.305: R5.2 49.58,22.85 74.98,22.85 LED13.1
N$98
  Top 0.305: R6.2 50.85,21.58 73.71,21.58 LED14.1
N$99
  Top 0.305: R7.2 52.12,20.31 72.44,20.31 LED15.1
N$100
  Top 0.305: R8.2 70.54,19.04 76.89,12.69 LED16.1
N$101
  Top 0.305: IC6.18 R81.2
N$102
  Top 0.305: R82.2 IC9.18
N$108
  Top 0.305: R83.2 40.69,54.6 IC9.15
PE
  pour Bottom: 78.79,-0.01 0.05,-0.01 0.05,105.4 78.79,105.4

### Text on the board
tNames: 1 | 2 | 3 | 4 | 5 | 6 | 7 | 8 | 9 | Rob Ellis 2020 | OUTPUTS | 10 | 11 | 12 | 13 | 14 | 15 | 16